# Altium schematic sheet I2C0_Mux.SchDoc
size A4; Organization: UltraZohm; SheetNumber: 15
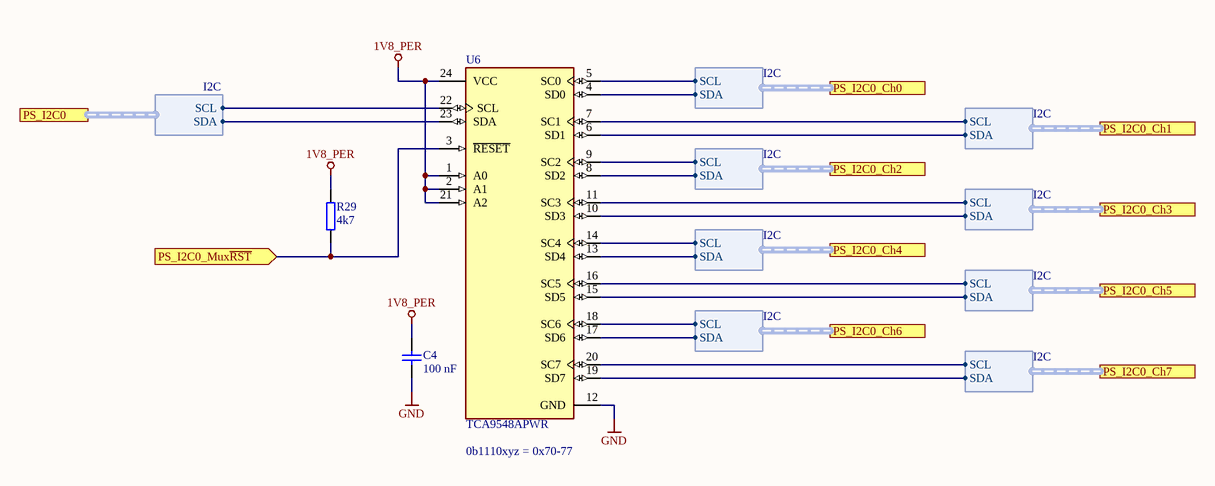
[diagram p0: I2C0_Mux.SchDoc]

## Parts
C4  100 nF  [C_0603_TE]
R29  4k7  [R_0603_TE]
U6  TCA9548APWR  [FP-PW0024A-IPC_A]

## Ports
PS_I2C0 (harness I2C), PS_I2C0_Ch0 (harness I2C), PS_I2C0_Ch1 (harness I2C), PS_I2C0_Ch2 (harness I2C), PS_I2C0_Ch3 (harness I2C), PS_I2C0_Ch4 (harness I2C), PS_I2C0_Ch5 (harness I2C), PS_I2C0_Ch6 (harness I2C), PS_I2C0_Ch7 (harness I2C), PS_I2C0_Mux~{RST} (in)

## Harnesses
I2C: SCL, SDA

## Nets
1V8_PER: C4.2 R29.2 U6.1(A0) U6.2(A1) U6.21(A2) U6.24(VCC)
GND: C4.1 U6.12(GND)
PS_I2C0_Mux~{RST}: R29.1 U6.3(~{RESET}) ; port PS_I2C0_Mux~{RST}
NetU6_4: U6.4(SD0) ; port PS_I2C0_Ch0.SDA
NetU6_5: U6.5(SC0) ; port PS_I2C0_Ch0.SCL
NetU6_6: U6.6(SD1) ; port PS_I2C0_Ch1.SDA
NetU6_7: U6.7(SC1) ; port PS_I2C0_Ch1.SCL
NetU6_8: U6.8(SD2) ; port PS_I2C0_Ch2.SDA
NetU6_9: U6.9(SC2) ; port PS_I2C0_Ch2.SCL
NetU6_10: U6.10(SD3) ; port PS_I2C0_Ch3.SDA
NetU6_11: U6.11(SC3) ; port PS_I2C0_Ch3.SCL
NetU6_13: U6.13(SD4) ; port PS_I2C0_Ch4.SDA
NetU6_14: U6.14(SC4) ; port PS_I2C0_Ch4.SCL
NetU6_15: U6.15(SD5) ; port PS_I2C0_Ch5.SDA
NetU6_16: U6.16(SC5) ; port PS_I2C0_Ch5.SCL
NetU6_17: U6.17(SD6) ; port PS_I2C0_Ch6.SDA
NetU6_18: U6.18(SC6) ; port PS_I2C0_Ch6.SCL
NetU6_19: U6.19(SD7) ; port PS_I2C0_Ch7.SDA
NetU6_20: U6.20(SC7) ; port PS_I2C0_Ch7.SCL
NetU6_22: U6.22(SCL) ; port PS_I2C0.SCL
NetU6_23: U6.23(SDA) ; port PS_I2C0.SDA

## Notes on the sheet
- (near U6) 0b1110xyz = 0x70-77
- Title
- Revision:
- Design Engineer:
- Date:
- Project:
- Sheet
- of

## Library data of the parts
C4 = UZgen_C_0603_100nF_50V_X7R: Generic capacitor; Manufacturer: UZgen; Voltage: 50 V; Tolerance: 10 %; Created from: AGeiger; Manufacturer Part Number: UZgen_C_0603_100nF_50V_X7R; PartID: 1; Created On: 02/07/2024 14:42:23; Value: 100 nF; Device Package: 0603; Technology: X7R; Mounting Type: SMD; Last Updated: 02/08/2024 14:45:57
R29 = UZgen_R_0603_4k7: Generic resistor; Manufacturer: UZgen; Tolerance: 1 %; Created from: UZgenTool; Manufacturer Part Number: UZgen_R_0603_4k7; PartID: 237; Created On: 02/07/2024 17:29:50; Value: 4k7; Device Package: 0603; Mounting Type: SMD; Last Updated: 02/07/2024 17:29:50
U6 = TCA9548APWR: Switch ICs - Various 8-Channel I2C Switch; Manufacturer: Texas Instruments; Created from: FRosner; ComponentLink2Description: Datasheet; ComponentLink2URL: http://www.ti.com/lit/ds/symlink/tca9548a.pdf; Manufacturer Part Number: TCA9548APWR; PartID: 35; Created On: 13/06/2024 10:28:56; ComponentLink1Description: Datasheet; ComponentLink1URL: https://www.ti.com/lit/ds/symlink/tca9548a.pdf; Component Type: 8-Channel I2C Switch; Device Package: TSSOP-24; Last Updated: 08/07/2024 12:56:02; Mounting Type: SMD/SMT; Operating Temperature: -40°C - +85°C; Series: TCA9548; Supplier 1: Mouser; Supplier Part Number 1: 595-TCA9548APWR; Supplier 2: LCSC; Supplier Part Number 2: C130026; Type: Switch ICs - Various; Value: TCA9548APWR; Live Cycle Status: 1; LCSC Part Number: C130026